# EAGLE design LEDAppBoard-0BAC0304 (EAGLE 5.10)
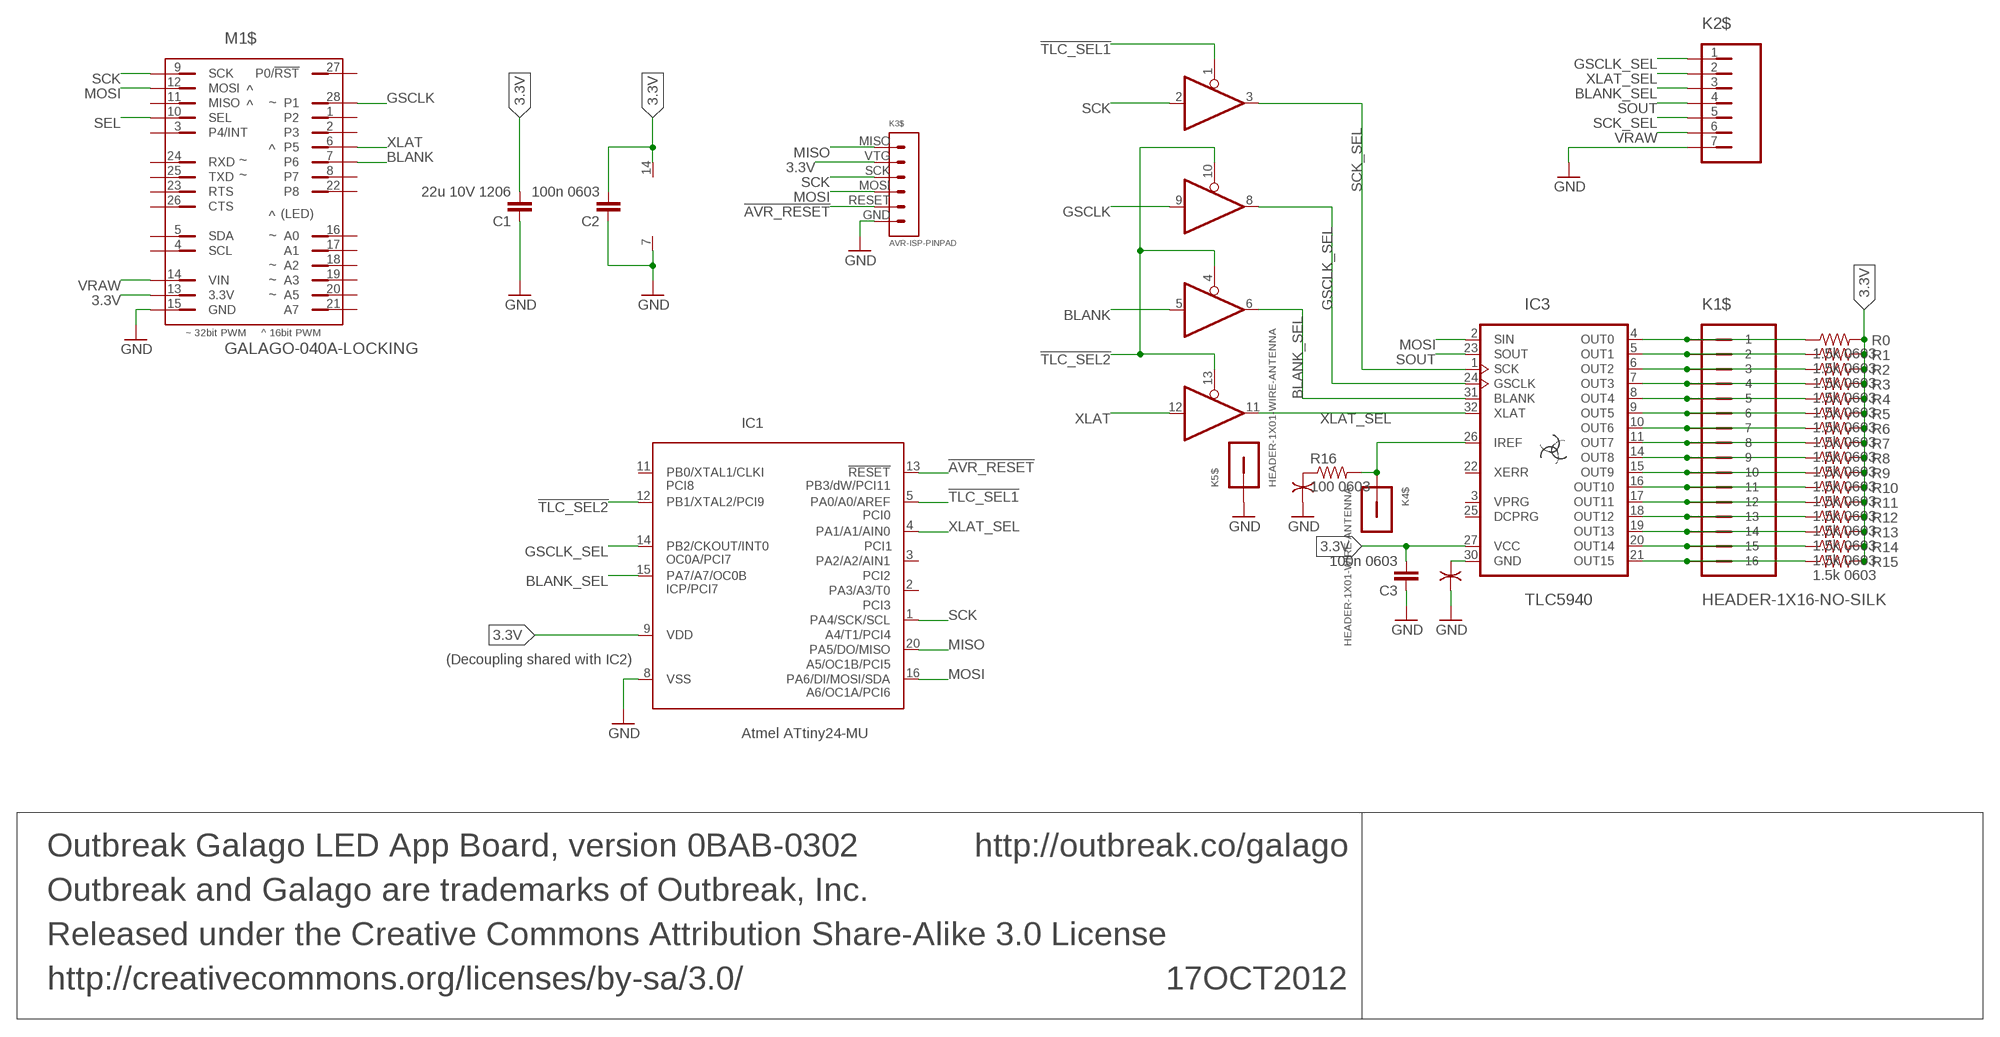
[diagram p0: schematic, sheet 1]

## Parts
17OCT2012  Outbreak Galago LED App Board, version 0BAB-0302  INFO-BLOCK  [INFO-BLOCK]
C1  22u 10V 1206  CAP-1206  [1206]
C2  100n 0603  CAP-0603-MIN  [0603-MIN]
C3  100n 0603  CAP-0603-MIN  [0603-MIN]
G1$  GND-ISOLATOR-0.008"  [GND-ISOLATOR-0.008"]
G2$  GND-ISOLATOR-0.008"  [GND-ISOLATOR-0.008"]
IC1  Atmel ATtiny24-MU  AVR-ATTINY24/44/84-QFN20  [QFN20-0.5MM]
IC2  74HC125-TSSOP14  [TSSOP14]
IC3  TLC5940  TI-TLC5940-QFN32  [QFN32-0.5MM]
K1$  HEADER-1X16-NO-SILK  [HEADER-1X16-NO-SILK]
K2$  HEADER-1X07-NO-SILK  [HEADER-1X07-NO-SILK]
K3$  AVR-ISP-PINPAD  [AVR-ISP-PINPAD]
K4$  HEADER-1X01-WIRE-ANTENNA  [HEADER-1X01-WIRE-ANTENNA]
K5$  HEADER-1X01-WIRE-ANTENNA  [HEADER-1X01-WIRE-ANTENNA]
M1$  GALAGO-040A-LOCKING  [GALAGO-LOCKING]
R0  1.5k 0603  RESISTOR-0603-MIN  [0603-MIN]
R1  1.5k 0603  RESISTOR-0603-MIN  [0603-MIN]
R2  1.5k 0603  RESISTOR-0603-MIN  [0603-MIN]
R3  1.5k 0603  RESISTOR-0603-MIN  [0603-MIN]
R4  1.5k 0603  RESISTOR-0603-MIN  [0603-MIN]
R5  1.5k 0603  RESISTOR-0603-MIN  [0603-MIN]
R6  1.5k 0603  RESISTOR-0603-MIN  [0603-MIN]
R7  1.5k 0603  RESISTOR-0603-MIN  [0603-MIN]
R8  1.5k 0603  RESISTOR-0603-MIN  [0603-MIN]
R9  1.5k 0603  RESISTOR-0603-MIN  [0603-MIN]
R10  1.5k 0603  RESISTOR-0603-MIN  [0603-MIN]
R11  1.5k 0603  RESISTOR-0603-MIN  [0603-MIN]
R12  1.5k 0603  RESISTOR-0603-MIN  [0603-MIN]
R13  1.5k 0603  RESISTOR-0603-MIN  [0603-MIN]
R14  1.5k 0603  RESISTOR-0603-MIN  [0603-MIN]
R15  1.5k 0603  RESISTOR-0603-MIN  [0603-MIN]
R16  100 0603  RESISTOR-0603  [0603]

## Nets
3.3V: C1.1 C2.1 C3.1 IC1.9(VDD) IC2.14(VDD) IC3.27(VCC) K3$.VTG M1$.13(3.3V) R0.2 R1.2 R2.2 R3.2 R4.2 R5.2 R6.2 R7.2 R8.2 R9.2 R10.2 R11.2 R12.2 R13.2 R14.2 R15.2
!AVR_RESET: IC1.13(!RESET) K3$.RESET
!TLC_SEL1: IC1.5(PA0/A0/AREF) IC2.1(EN)
!TLC_SEL2: IC1.12(PB1/XTAL2/PCI9) IC2.4(EN) IC2.10(EN) IC2.13(EN)
BLANK: IC2.5(A) M1$.7(P6)
BLANK_SEL: IC1.15(PA7/A7/OC0B) IC2.6(Y) IC3.31(BLANK) K2$.3
GND: C1.2 C2.2 C3.2 G1$.1(A) G2$.1(A) IC1.8(VSS) IC2.7(VSS) K2$.7 K3$.GND K5$.1 M1$.15(GND)
GSCLK: IC2.9(A) M1$.28(P1)
GSCLK_SEL: IC1.14(PB2/CKOUT/INT0) IC2.8(Y) IC3.24(GSCLK) K2$.1
IREF: IC3.26(IREF) K4$.1 R16.2
MISO: IC1.20(PA5/DO/MISO) K3$.MISO
MOSI: IC1.16(PA6/DI/MOSI/SDA) IC3.2(SIN) K3$.MOSI M1$.12(MOSI)
N$18: G2$.2(B) R16.1
N$19: IC3.4(OUT0) K1$.1 R0.1
N$21: IC3.5(OUT1) K1$.2 R1.1
N$22: IC3.6(OUT2) K1$.3 R2.1
N$23: IC3.7(OUT3) K1$.4 R3.1
N$24: IC3.8(OUT4) K1$.5 R4.1
N$25: IC3.9(OUT5) K1$.6 R5.1
N$26: IC3.10(OUT6) K1$.7 R6.1
N$27: IC3.11(OUT7) K1$.8 R7.1
N$28: IC3.14(OUT8) K1$.9 R8.1
N$29: IC3.15(OUT9) K1$.10 R9.1
N$30: IC3.16(OUT10) K1$.11 R10.1
N$31: IC3.17(OUT11) K1$.12 R11.1
N$32: IC3.18(OUT12) K1$.13 R12.1
N$33: IC3.19(OUT13) K1$.14 R13.1
N$34: IC3.20(OUT14) K1$.15 R14.1
N$35: IC3.21(OUT15) K1$.16 R15.1
SCK: IC1.1(PA4/SCK/SCL) IC2.2(A) K3$.SCK M1$.9(SCK)
SCK_SEL: IC2.3(Y) IC3.1(SCK) K2$.5
SEL: M1$.10(SEL)
SOUT: IC3.23(SOUT) K2$.4
THERMGND: G1$.2(B) IC3.30(GND)
VRAW: K2$.6 M1$.14(VIN)
XLAT: IC2.12(A) M1$.6(P5)
XLAT_SEL: IC1.4(PA1/A1/AIN0) IC2.11(Y) IC3.32(XLAT) K2$.2
Unconnected: IC1.2(PA3/A3/T0) IC1.3(PA2/A2/AIN1) IC1.11(PB0/XTAL1/CLKI) IC3.3(VPRG) IC3.22(XERR) IC3.25(DCPRG) M1$.1(P2) M1$.2(P3) M1$.3(P4/INT) M1$.4(SCL) M1$.5(SDA) M1$.8(P7) M1$.11(MISO) M1$.16(A0) M1$.17(A1) M1$.18(A2) M1$.19(A3) M1$.20(A5) M1$.21(A7) M1$.22(P8) M1$.23(RTS) M1$.24(RXD) M1$.25(TXD) M1$.26(CTS) M1$.27(P0/!RST)

## Notes on the sheet
- (Decoupling shared with IC2)

## Library data of the parts
17OCT2012 = Outbreak:INFO-BLOCK
C1-C3 = Outbreak:CAP
G1$ G2$ = Outbreak:GND-ISOLATOR
IC1 = Outbreak:AVR-ATTINY24/44/84
IC2 = Outbreak:74HC125
IC3 = Outbreak:TI-TLC5940
K1$ = Outbreak:HEADER-1X16-NO-SILK
K2$ = Outbreak:HEADER-1X07-NO-SILK
K3$ = Outbreak:AVR-ISP-PINPAD
K4$ K5$ = Outbreak:HEADER-1X01
M1$ = Outbreak-v0:GALAGO-040A
R0 R1-R16 = Outbreak:RESISTOR: Resistor Basic schematic elements and footprints for 0603, 1206, and PTH resistors.

## Board
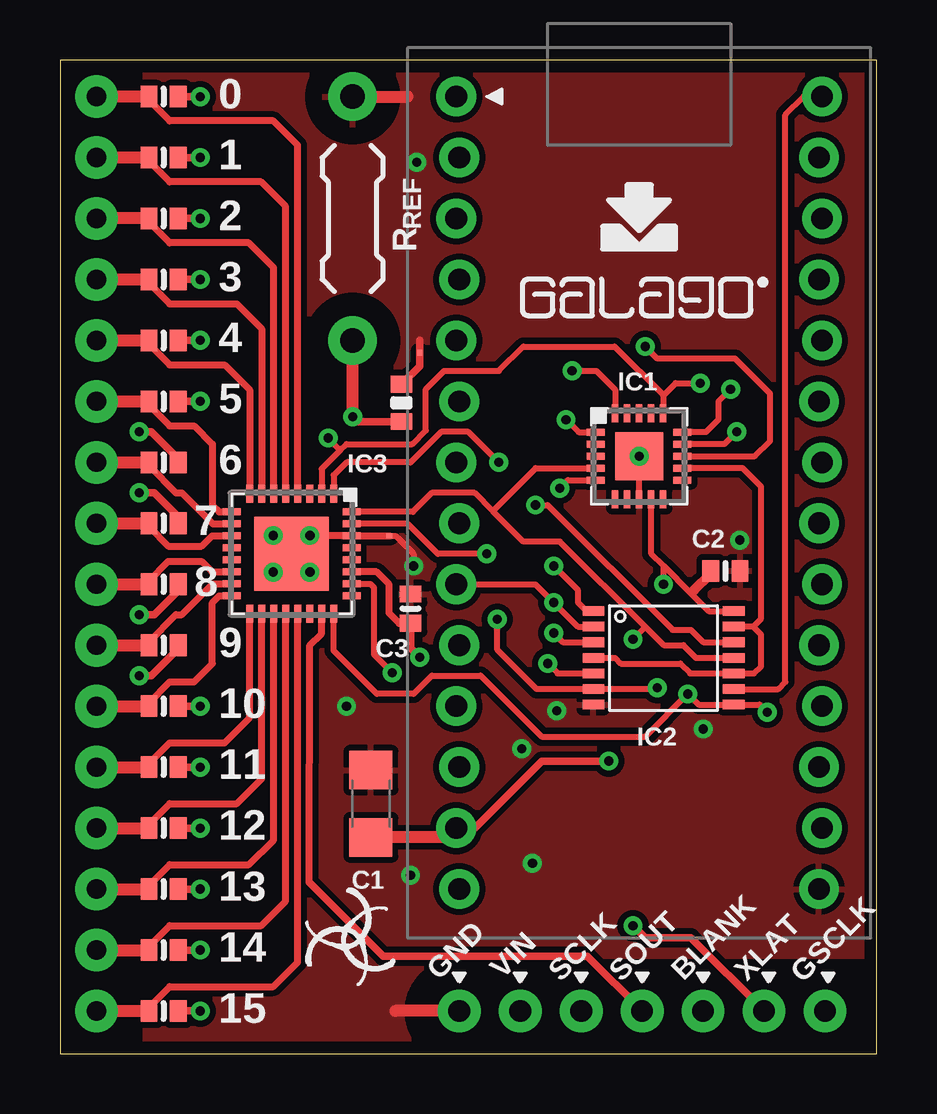
[diagram p1: board, top side]
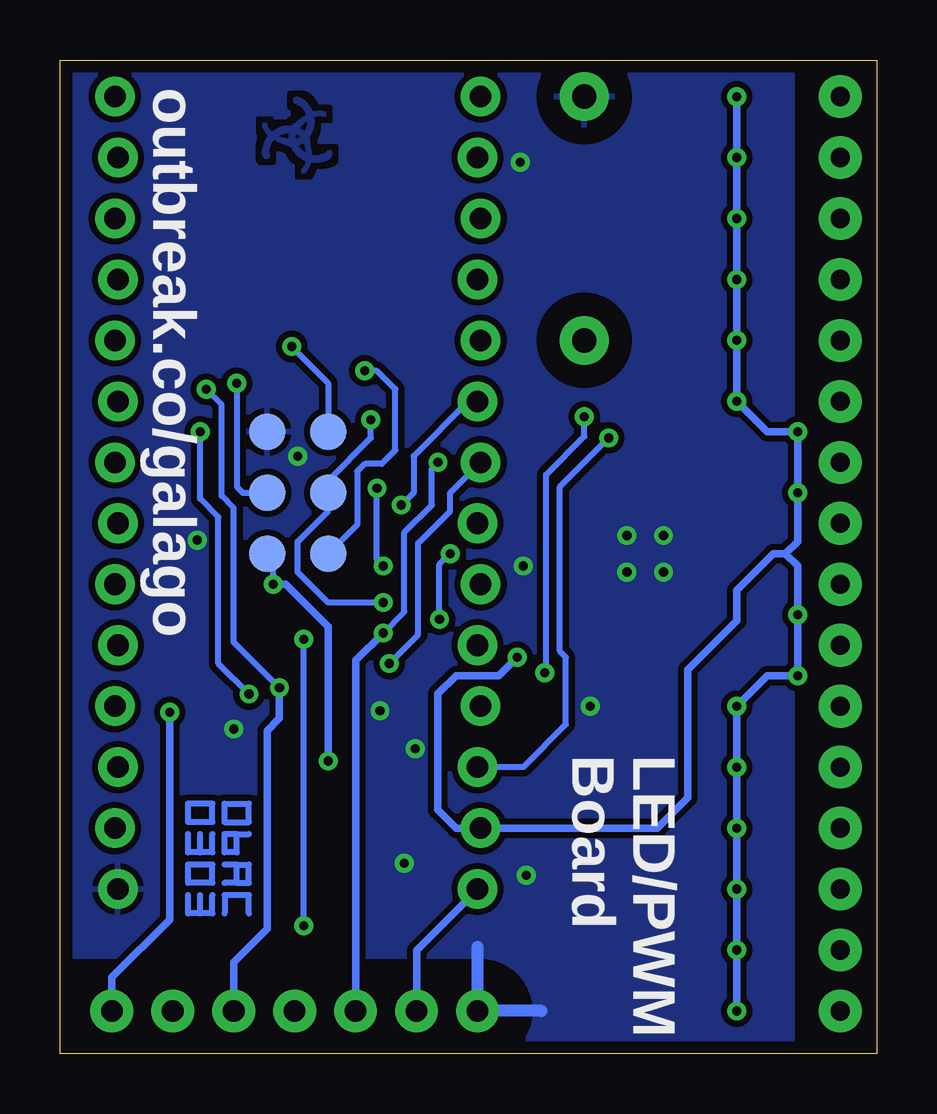
[diagram p2: board, bottom side, seen from below]

Size 34.04 x 41.4 mm. Coordinates in mm from the lower left corner, seen from the top.
Outline: 0,0 34.04,0 34.04,41.4 0,41.4 0,0
Copper layers (1*16): Top 0.035mm / dielectric 1.5mm / Bottom 0.035mm
Design rules "default *": minimum track width 8mil, minimum drill 20mil, track to track 8mil, track to pad 8mil, pad to pad 8mil, via to via 8mil, smd to smd 8mil, copper to edge 20mil, drill to drill 8mil, minimum pad ring 10mil, minimum via ring 8mil, stop-mask expansion 4mil, vias tented up to drill 25mil, thermal gap 10mil
tRestrict: area 10.6,28.1 to 13.8,31.3; area 14.7,0 to 33.8,3.6; area 10.6,38.3 to 13.8,41.5
bRestrict: area 10.6,28.1 to 13.8,31.3; area 14.7,0 to 33.8,3.6; area 10.6,38.3 to 13.8,41.5

### Footprints (pad centres in the part's own frame; a part is rotated, then mirrored left to right if it is on the bottom)
1206 = smd 1.6 x 1.8: 1 -1.4,0; 2 1.4,0
0603-MIN = smd 0.7 x 0.9: 1 -0.61,0; 2 0.61,0
GND-ISOLATOR-0.008" = smd 0.203 x 0.203: 1 -0.025,0; 2 0.025,0
QFN20-0.5MM = smd 0.75 x 0.28: 1 -1.8,1; 2 -1.8,0.5; 3 -1.8,0; 4 -1.8,-0.5; 5 -1.8,-1; 11 1.8,-1; 12 1.8,-0.5; 13 1.8,0; 14 1.8,0.5; 15 1.8,1 | smd 0.28 x 0.75: 6 -1,-1.8; 7 -0.5,-1.8; 8 0,-1.8; 9 0.5,-1.8; 10 1,-1.8; 16 1,1.8; 17 0.5,1.8; 18 0,1.8; 19 -0.5,1.8; 20 -1,1.8 | smd 2 x 2: G1 0,0
TSSOP14 = smd 0.4 x 0.9: 1 2.275,2.925; 2 1.625,2.925; 3 0.975,2.925; 4 0.325,2.925; 5 -0.325,2.925; 6 -0.975,2.925; 7 -1.625,2.925; 8 -1.625,-2.925; 9 -0.975,-2.925; 10 -0.325,-2.925; 11 0.325,-2.925; 12 0.975,-2.925; 13 1.625,-2.925; 14 2.275,-2.925
QFN32-0.5MM = smd 0.75 x 0.295: 1 -2.5,1.75; 2 -2.5,1.25; 3 -2.5,0.75; 4 -2.5,0.25; 5 -2.5,-0.25; 6 -2.5,-0.75; 7 -2.5,-1.25; 8 -2.5,-1.75; 17 2.5,-1.75; 18 2.5,-1.25; 19 2.5,-0.75; 20 2.5,-0.25; 21 2.5,0.25; 22 2.5,0.75; 23 2.5,1.25; 24 2.5,1.75 | smd 0.295 x 0.75: 9 -1.75,-2.5; 10 -1.25,-2.5; 11 -0.75,-2.5; 12 -0.25,-2.5; 13 0.25,-2.5; 14 0.75,-2.5; 15 1.25,-2.5; 16 1.75,-2.5; 25 1.75,2.5; 26 1.25,2.5; 27 0.75,2.5; 28 0.25,2.5; 29 -0.25,2.5; 30 -0.75,2.5; 31 -1.25,2.5; 32 -1.75,2.5 | smd 3.1 x 3.1: G1 0,0
HEADER-1X16-NO-SILK = drill 0.8 pad 1.778 round: 1 -19.05,0; 2 -16.51,0; 3 -13.97,0; 4 -11.43,0; 5 -8.89,0; 6 -6.35,0; 7 -3.81,0; 8 -1.27,0; 9 1.27,0; 10 3.81,0; 11 6.35,0; 12 8.89,0; 13 11.43,0; 14 13.97,0; 15 16.51,0; 16 19.05,0
HEADER-1X07-NO-SILK = drill 0.9 pad 1.778 round: 1 -7.62,0; 2 -5.08,0; 3 -2.54,0; 4 0,0; 5 2.54,0; 6 5.08,0; 7 7.62,0
AVR-ISP-PINPAD = smd 1.524 x 1.524: GND 2.54,1.27; MISO -2.54,-1.27; MOSI 0,1.27; RESET 2.54,-1.27; SCK 0,-1.27; VTG -2.54,1.27
HEADER-1X01-WIRE-ANTENNA = drill 1.016 pad 2.032 round: 1 0,0
GALAGO-LOCKING = drill 0.9 pad 1.651 round: 1 -7.62,16.51; 2 -7.493,13.97; 3 -7.62,11.43; 4 -7.493,8.89; 5 -7.62,6.35; 6 -7.493,3.81; 7 -7.62,1.27; 8 -7.493,-1.27; 9 -7.62,-3.81; 10 -7.493,-6.35; 11 -7.62,-8.89; 12 -7.493,-11.43; 13 -7.62,-13.97; 14 -7.493,-16.51; 15 7.493,-16.51; 16 7.62,-13.97; 17 7.493,-11.43; 18 7.62,-8.89; 19 7.493,-6.35; 20 7.62,-3.81; 21 7.493,-1.27; 22 7.62,1.27; 23 7.493,3.81; 24 7.62,6.35; 25 7.493,8.89; 26 7.62,11.43; 27 7.493,13.97; 28 7.62,16.51
0603 = smd 0.7 x 0.9: 1 -0.777,0; 2 0.777,0

### Placement (x,y rotation side)
17OCT2012  -7.37,-2.29 0 top  (outside the outline)
C1  12.95,10.41 90 top
C2  27.72,20.12 0 top
C3  14.61,18.54 90 top
G1$  13.72,21.58 0 top
G2$  14.99,29.21 270 top
IC1  24.13,24.89 0 top
IC2  25.15,16.17 90 top
IC3  9.65,20.83 270 top
K1$  1.52,20.83 270 top
K2$  24.26,1.78 180 top
K3$  24.13,23.37 90 bottom
K4$  12.19,29.72 0 top
K5$  12.19,39.88 0 top
M1$  24.13,23.37 0 top
R0  4.32,39.88 0 top
R1  4.32,37.34 0 top
R2  4.32,34.8 0 top
R3  4.32,32.26 0 top
R4  4.32,29.72 0 top
R5  4.32,27.18 0 top
R6  4.32,24.64 0 top
R7  4.32,22.1 0 top
R8  4.32,19.56 0 top
R9  4.32,17.02 0 top
R10  4.32,14.48 0 top
R11  4.32,11.94 0 top
R12  4.32,9.4 0 top
R13  4.32,6.86 0 top
R14  4.32,4.32 0 top
R15  4.32,1.78 0 top
R16  14.22,27.11 270 top
U$3  [GALAGO-LOGO]  24.13,31.5 0 top
U$4  [GALAGO-APP-BOARD-SYMBOL]  24.13,34.29 0 top

### Tracks (layer width: path | path; a pad name or v marks a point on that pad's centre or on a via)
3.3V  (via drill 0.38)
  Top 0.254: IC1.9 24.64,20.83 25.15,20.32 | 25.15,20.32 26.29,19.18 | 26.29,19.18 26.42,19.3 | v25.15,19.56 25.15,20.32 | 26.29,19.18 27.02,18.44 IC2.14
  Top 0.292: IC3.27 13.2,20.08 13.72,19.56 13.72,18.35 14.13,17.93 C3.1
  Top 0.305: v5.84,39.88 R0.2 | v5.84,37.34 R1.2 | v5.84,34.8 R2.2 | v5.84,32.26 R3.2 | v5.84,29.72 R4.2 | v5.84,27.18 R5.2 | R15.2 v5.84,1.78 | v5.84,4.32 R14.2 | v5.84,6.86 R13.2 | v5.84,9.4 R12.2 | v5.84,11.94 R11.2 | v5.84,14.48 R10.2 | R7.2 4.93,22.38 3.94,23.37 v3.3,23.37 | R8.2 4.93,19.28 3.94,18.29 v3.3,18.29 | R9.2 4.93,16.87 3.81,15.75 v3.3,15.75 | R6.2 4.93,24.79 3.81,25.91 v3.3,25.91 | C3.1 14.61,16.89 v14.99,16.51 | v22.86,12.19 20.07,12.19 17.27,9.4 M1$.13
  Top 0.406: C2.1 27.11,20 26.42,19.3
  Top 0.508: M1$.13 16.13,9.01 C1.1
  Bottom 0.254: K3$.VTG 25.15,20.57 v25.15,19.56
  Bottom 0.305: v5.84,39.88 v5.84,37.34 v5.84,34.8 v5.84,32.26 v5.84,29.72 v5.84,27.18 4.57,25.91 v3.3,25.91 v3.3,23.37 3.3,21.34 3.81,20.83 | v5.84,1.78 v5.84,4.32 v5.84,6.86 v5.84,9.4 v5.84,11.94 v5.84,14.48 4.57,15.75 v3.3,15.75 v3.3,18.29 3.3,20.32 3.81,20.83 | v14.99,16.51 15.75,15.75 17.53,15.75 18.29,14.99 18.29,10.16 17.53,9.4 M1$.13 9.14,9.4 7.87,10.67 7.87,16 5.84,18.03 5.84,19.3 4.32,20.83 3.81,20.83 | v25.15,19.56 24.64,19.56 22.86,17.78 v22.86,12.19
!AVR_RESET  (via drill 0.38)
  Top 0.254: IC1.13 28.96,24.89 29.59,25.53 29.59,27.5 28.13,28.96 24.89,28.96 v24.38,29.46
  Bottom 0.254: K3$.RESET 22.86,27.94 v24.38,29.46
!TLC_SEL1  (via drill 0.38)
  Top 0.254: v20.57,20.32 21.59,19.3 21.59,18.8 21.94,18.44 IC2.1 | v20.83,23.56 21.16,23.89 IC1.5
  Bottom 0.254: v20.57,20.32 20.83,20.57 v20.83,23.56
!TLC_SEL2
  Top 0.254: IC1.12 28.44,24.39 29.21,23.62 29.21,18.12 28.88,17.79 | IC2.4 23.13,16.49 23.37,16.26 25.84,16.26 26.26,15.84 IC2.10 28.92,15.84 29.21,16.13 29.21,17.46 28.88,17.79 | 28.88,17.79 IC2.13
BLANK  (via drill 0.38)
  Top 0.254: v20.32,16.26 20.73,15.84 IC2.5
  Bottom 0.254: v20.32,16.26 19.11,17.46 19.11,21.27 17.78,22.61 17.78,23.37 M1$.7
BLANK_SEL  (via drill 0.38)
  Top 0.254: v17.78,20.83 15.75,20.83 14.5,22.08 IC3.31 | v18.22,18.1 18.22,16.83 19.86,15.19 IC2.6 24.84,15.19 v24.89,15.24 | v27.94,27.69 27.43,27.18 27.43,26.42 26.91,25.89 IC1.15
  Bottom 0.254: v18.22,18.1 18.22,20.38 v17.78,20.83 | v24.89,15.24 26.8,17.14 26.8,22.73 27.3,23.24 27.3,27.05 v27.94,27.69
  Bottom 0.305: K2$.3 26.8,3.81 25.4,5.21 25.4,13.46 24.89,13.97 v24.89,15.24
GND  (via drill 0.38)
  Top 0.254: G1$.1 13.98,21.58 14.73,20.83 v14.73,20.32 | IC1.8 v24.13,24.89
  Top 0.305: G2$.1 14.99,29.72
  Top 0.508: K5$.1 14.48,39.88 | K2$.7 13.97,1.78
  Bottom 0.508: 16.64,4.45 K2$.7 13.97,1.78
  other vias: 8.89,21.59 10.41,20.07 10.41,21.59 8.89,20.07 28.32,21.4 20.7,14.29 26.8,13.53 19.68,7.94 14.61,7.43 11.94,14.48 14.86,37.15 19.24,12.7
  pour Top (isolate 0.254): 3.56,41.4 3.56,0 34.04,0 34.04,41.4
  pour Bottom (isolate 0.254, rank 2): 3.56,41.4 3.56,0 34.04,0 34.04,41.4
GSCLK
  Top 0.254: M1$.28 30.99,39.88 30.23,39.12 30.23,15.49 29.92,15.19 IC2.9
GSCLK_SEL  (via drill 0.38)
  Top 0.254: IC3.24 11.4,16.79 13.21,14.99 14.73,14.99 15.49,15.75 17.53,15.75 20.07,13.21 24.38,13.21 v26.16,14.99 26.61,14.54 IC2.8 29.15,14.54 v29.46,14.22 | IC1.14 27.68,25.39 v28.19,25.91
  Bottom 0.254: v26.16,14.99 27.43,16.26 27.43,22.35 28.19,23.11 v28.19,25.91
  Bottom 0.305: K2$.1 31.88,3.17 29.46,5.59 v29.46,14.22
IREF  (via drill 0.38)
  Top 0.254: IC3.26 12.93,19.58 13.08,19.43 13.08,16.64 v13.84,15.88
  Top 0.305: v12.19,26.54 12.4,26.34 R16.2
  Top 0.508: v12.19,26.54 K4$.1
  Bottom 0.254: v13.84,15.88 13.78,15.94 13.78,24.13 12.19,25.72 v12.19,26.54
MISO  (via drill 0.38)
  Top 0.254: v21.34,28.45 22.35,28.45 23.13,27.67 IC1.20
  Bottom 0.254: K3$.MISO 21.65,22.04 21.65,24.26 21.34,24.57 20.64,24.57 20.07,25.15 20.07,27.69 20.83,28.45 v21.34,28.45
MOSI  (via drill 0.38)
  Top 0.254: IC3.2 10.9,24.36 11.68,25.15 | 11.68,25.15 11.94,25.4 14.67,25.4 15.24,25.97 15.24,27.69 16,28.45 18.29,28.45 19.3,29.46 23.11,29.46 25.13,27.45 25.13,27.42 | v11.18,25.65 11.68,25.15 | v26.67,27.94 25.65,27.94 25.13,27.42 | 25.13,27.42 IC1.16
  Bottom 0.254: M1$.12 14.73,11.94 12.95,13.72 12.95,16.51 13.21,16.76 13.21,23.62 v11.18,25.65 | K3$.MOSI 26.42,23.37 26.67,23.62 v26.67,27.94
N$1
  Bottom 0.254: 26.16,9.65 26.16,10.41 27.18,10.41 27.18,9.65 26.16,9.65
N$2
  Bottom 0.254: 26.67,9.14 27.18,9.14 27.18,8.38 26.67,8.38 26.67,9.14 | 26.67,9.14 26.16,9.14
N$3
  Bottom 0.254: 26.67,7.11 26.16,7.11 26.16,7.87 26.67,7.87 | 26.67,7.11 27.18,7.11 | 26.67,7.87 27.18,7.87 | 26.67,7.11 26.67,7.87
N$4
  Bottom 0.254: 27.18,5.84 27.18,6.6 26.16,6.6 26.16,5.84
N$5
  Bottom 0.254: 27.69,9.65 27.69,10.41 28.7,10.41 28.7,9.65 27.69,9.65
N$6
  Bottom 0.254: 27.69,9.14 27.69,8.38 28.19,8.38 | 28.19,8.38 28.19,9.14 | 28.7,9.14 28.7,8.38 28.19,8.38
N$7
  Bottom 0.254: 27.69,7.11 27.69,7.87 28.7,7.87 28.7,7.11 27.69,7.11
N$8
  Bottom 0.254: 27.69,6.6 27.69,5.84 28.19,5.84 | 28.19,5.84 28.19,6.6 | 28.7,6.6 28.7,5.84 28.19,5.84
N$9
  pour Bottom: 23.13,39.18 23.17,39.18 23.26,39.18 23.34,39.17 23.42,39.16 23.5,39.14 23.54,39.13 23.53,39.1 23.5,39.11 23.45,39.13 23.4,39.15 23.34,39.16 23.29,39.16 23.23,39.17 23.18,39.17 23.12,39.16 23.07,39.15 23.07,39.15 23.06,39.15 23.04,39.13 23.04,39.13 23.04,39.12 23.03,39.12 23.03,39.12 23.02,39.12 23.02,39.12 23.02,39.13 23.02,39.14 23.03,39.15 23.05,39.16 23.06,39.17 23.08,39.17 23.09,39.18 23.1,39.18 23.11,39.18
N$10
  pour Bottom: 23.67,39.1 23.67,39.08 23.66,39.03 23.66,39.03 23.65,39.01 23.64,38.93 23.64,38.86 23.64,38.78 23.65,38.71 23.66,38.63 23.68,38.56 23.71,38.49 23.74,38.41 23.74,38.41 23.79,38.33 23.79,38.32 23.77,38.31 23.75,38.3 23.74,38.28 23.73,38.25 23.7,38.28 23.66,38.34 23.66,38.34 23.62,38.43 23.58,38.51 23.55,38.6 23.53,38.69 23.52,38.77 23.52,38.86 23.53,38.96 23.54,39.05 23.55,39.09 23.56,39.13 23.57,39.14 23.59,39.21 23.61,39.26 23.64,39.31 23.66,39.36 23.7,39.41 23.73,39.46 23.78,39.51 23.82,39.56 23.87,39.61 23.91,39.65 23.96,39.69 24,39.72 24.03,39.74 24.07,39.76 24.1,39.76 24.12,39.77 24.15,39.76 24.16,39.76 24.18,39.76 24.2,39.76 24.21,39.76 24.21,39.76 24.22,39.75 24.23,39.74 24.23,39.74 24.25,39.72 24.25,39.7 24.25,39.7 24.24,39.69 24.23,39.69 24.21,39.68 24.18,39.67 24.1,39.63 24.03,39.59 23.97,39.55 23.92,39.51 23.87,39.47 23.83,39.42 23.79,39.38 23.76,39.32 23.73,39.27 23.71,39.21 23.67,39.1
N$11
  pour Bottom: 23.7,39.02 23.7,39.02 23.68,39.03 23.69,39.06 23.71,39.05 23.79,39.01 23.86,38.95 23.93,38.9 24,38.85 24.06,38.8 24.11,38.75 24.16,38.71 24.21,38.68 24.25,38.65 24.29,38.62 24.33,38.59 24.36,38.55 24.38,38.53 24.4,38.5 24.4,38.48 24.4,38.45 24.4,38.45 24.4,38.45 24.39,38.41 24.38,38.37 24.38,38.34 24.39,38.31 24.39,38.29 24.4,38.27 24.4,38.26 24.4,38.25 24.4,38.25 24.41,38.21 24.41,38.16 24.4,38.11 24.39,38.04 24.39,38.04 24.39,38.04 24.39,38.04 24.31,38.03 24.31,38.04 24.32,38.1 24.33,38.14 24.33,38.19 24.33,38.23 24.32,38.27 24.3,38.32 24.28,38.37 24.26,38.42 24.26,38.42 24.25,38.43 24.23,38.48 24.19,38.52 24.18,38.54 24.12,38.63 24.06,38.71 23.99,38.78 23.92,38.85 23.87,38.9 23.81,38.94 23.76,38.98
N$12
  pour Bottom: 23.74,38.19 23.74,38.22 23.74,38.22 23.75,38.25 23.77,38.28 23.79,38.3 23.81,38.31 23.81,38.31 23.82,38.31 23.83,38.31 23.87,38.32 23.9,38.33 23.92,38.35 23.94,38.37 23.94,38.37 23.99,38.41 24.02,38.43 24.06,38.46 24.1,38.48 24.16,38.5 24.18,38.5 24.18,38.51 24.18,38.51 24.2,38.47 24.22,38.43 24.18,38.42 24.14,38.41 24.1,38.39 24.07,38.38 24.05,38.36 24.01,38.33 23.98,38.29 23.95,38.26 23.92,38.21 23.92,38.21 23.9,38.19 23.85,38.09 23.83,38.06 23.79,37.97 23.76,37.88 23.73,37.79 23.7,37.69 23.69,37.62 23.68,37.54 23.67,37.47 23.67,37.41 23.67,37.4 23.64,37.39 23.64,37.41 23.64,37.41 23.64,37.5 23.65,37.59 23.66,37.68 23.68,37.84 23.7,37.91 23.7,37.97 23.71,38.03 23.72,38.08 23.73,38.13 23.73,38.16
N$13
  pour Bottom: 23.68,37.38 23.71,37.38 23.78,37.41 23.85,37.45 23.91,37.49 23.97,37.53 24.03,37.58 24.08,37.63 24.13,37.69 24.18,37.76 24.22,37.82 24.23,37.84 24.25,37.83 24.27,37.83 24.3,37.83 24.33,37.83 24.32,37.82 24.27,37.72 24.27,37.72 24.22,37.64 24.17,37.57 24.1,37.5 24.04,37.43 23.96,37.38 23.88,37.33 23.8,37.29 23.7,37.26 23.69,37.26 23.64,37.25 23.61,37.24 23.56,37.23 23.51,37.22 23.45,37.22 23.39,37.22 23.33,37.22 23.27,37.23 23.21,37.24 23.14,37.25 23.08,37.27 23.01,37.29 22.96,37.31 22.92,37.33 22.88,37.35 22.85,37.37 22.83,37.39 22.81,37.41 22.8,37.43 22.8,37.43 22.8,37.45 22.79,37.46 22.79,37.46 22.78,37.48 22.78,37.49 22.78,37.49 22.78,37.5 22.78,37.52 22.79,37.53 22.79,37.54 22.8,37.55 22.81,37.55 22.82,37.55 22.83,37.54 22.84,37.53 22.87,37.51 22.94,37.46 23.01,37.42 23.01,37.42 23.07,37.39 23.13,37.36 23.19,37.34 23.25,37.33 23.31,37.32 23.38,37.32 23.44,37.32 23.5,37.33 23.59,37.35 23.63,37.36 23.63,37.36 23.68,37.38
N$14
  pour Bottom: 23.66,37.22 23.68,37.23 23.69,37.2 23.7,37.14 23.71,37.09 23.73,37.04 23.75,36.99 23.78,36.94 23.8,36.89 23.84,36.85 23.87,36.81 23.9,36.79 23.91,36.79 23.92,36.78 23.92,36.78 23.92,36.78 23.91,36.77 23.89,36.77 23.87,36.78 23.85,36.8 23.85,36.8 23.84,36.81 23.84,36.82 23.83,36.83 23.82,36.85 23.82,36.85 23.8,36.88 23.75,36.96 23.72,37.04 23.69,37.12 23.67,37.2
N$15
  pour Bottom: 24.39,38.55 24.5,38.56 24.6,38.56 24.7,38.55 24.79,38.53 24.87,38.5 24.96,38.46 25.04,38.42 25.12,38.36 25.19,38.3 25.2,38.29 25.2,38.29 25.23,38.26 25.26,38.23 25.26,38.23 25.29,38.19 25.29,38.19 25.32,38.15 25.36,38.1 25.39,38.05 25.41,38 25.44,37.94 25.46,37.88 25.48,37.82 25.5,37.75 25.51,37.69 25.52,37.63 25.53,37.59 25.53,37.54 25.53,37.51 25.52,37.47 25.51,37.45 25.49,37.43 25.49,37.43 25.48,37.42 25.47,37.4 25.47,37.39 25.46,37.38 25.46,37.38 25.45,37.38 25.43,37.37 25.43,37.37 25.41,37.37 25.4,37.37 25.39,37.37 25.39,37.38 25.38,37.39 25.39,37.4 25.39,37.42 25.39,37.45 25.39,37.45 25.4,37.54 25.4,37.62 25.4,37.69 25.39,37.75 25.38,37.82 25.36,37.88 25.33,37.93 25.31,37.99 25.27,38.04 25.23,38.09 25.16,38.17 25.14,38.19 25.1,38.23 25.1,38.23 25.1,38.23 25.09,38.24 25.03,38.29 24.96,38.33 24.9,38.36 24.83,38.39 24.76,38.42 24.68,38.44 24.61,38.45 24.53,38.46 24.43,38.46 24.43,38.49 24.42,38.51 24.41,38.53
N$16
  pour Bottom: 25.52,38.71 25.53,38.7 25.53,38.69 25.52,38.67 25.52,38.65 25.52,38.65 25.51,38.64 25.5,38.62 25.49,38.61 25.48,38.57 25.43,38.49 25.37,38.42 25.32,38.35 25.26,38.29 25.25,38.28 25.23,38.3 25.25,38.32 25.3,38.35 25.33,38.39 25.37,38.43 25.4,38.48 25.43,38.52 25.46,38.57 25.48,38.62 25.5,38.67 25.5,38.67 25.5,38.69 25.5,38.71 25.5,38.7 25.49,38.72 25.5,38.72 25.5,38.72 25.5,38.73 25.51,38.72 25.51,38.72 25.52,38.72
N$17
  pour Bottom: 25.08,38.19 25.08,38.19 25.09,38.2 25.11,38.18 25.09,38.16 25.02,38.12 24.94,38.09 24.85,38.05 24.78,38.02 24.7,38 24.64,37.97 24.58,37.95 24.52,37.92 24.47,37.9 24.43,37.88 24.43,37.88 24.4,37.87 24.37,37.86 24.34,37.85 24.31,37.85 24.28,37.85 24.26,37.86 24.23,37.87 24.23,37.87 24.23,37.88 24.23,37.88 24.21,37.89 24.19,37.91 24.16,37.93 24.14,37.95 24.12,37.95 24.12,37.95 24.09,37.96 24.08,37.96 24.06,37.97 24.06,37.97 24.06,37.97 24.02,37.98 23.98,38.01 23.94,38.03 23.9,38.07 23.88,38.09 23.88,38.09 23.88,38.09 23.92,38.16 23.95,38.13 23.94,38.13 23.98,38.1 24.01,38.08 24.04,38.06 24.07,38.05 24.07,38.05 24.12,38.03 24.16,38.02 24.22,38.02 24.27,38.01 24.29,38.01 24.29,38.01 24.4,38.01 24.42,38.01 24.52,38.02 24.62,38.04 24.72,38.06 24.82,38.09 24.89,38.11 24.95,38.14 25.02,38.16
N$18
  Top 0.305: R16.1 14.99,28.64 G2$.2
N$19
  Top 0.292: IC3.4 9.9,37.85 8.89,38.86 4.57,38.86 3.71,39.73
  Top 0.305: 3.71,39.73 R0.1
  Top 0.508: R0.1 K1$.1
N$21
  Top 0.292: IC3.5 9.4,35.3 8.38,36.32 4.57,36.32 3.71,37.19
  Top 0.305: 3.71,37.19 R1.1
  Top 0.508: R1.1 K1$.2
N$22
  Top 0.292: IC3.6 8.9,32.75 7.87,33.78 4.57,33.78 3.71,34.65
  Top 0.305: 3.71,34.65 R2.1
  Top 0.508: R2.1 K1$.3
N$23
  Top 0.292: IC3.7 8.4,30.21 7.37,31.24 4.57,31.24 3.71,32.11
  Top 0.305: R3.1 3.71,32.11
  Top 0.508: K1$.4 R3.1
N$24
  Top 0.292: IC3.8 7.9,27.66 6.86,28.7 4.57,28.7 3.71,29.57
  Top 0.305: R4.1 3.71,29.57
  Top 0.508: K1$.5 R4.1
N$25
  Top 0.292: IC3.9 6.63,22.58 6.35,22.86 6.35,25.4 5.59,26.16 4.57,26.16 3.71,27.03
  Top 0.305: R5.1 3.71,27.03
  Top 0.508: K1$.6 R5.1
N$26
  Top 0.292: IC3.10 6.37,22.08 5.08,23.37 4.83,23.37 3.71,24.49
  Top 0.305: R6.1 3.71,24.49
  Top 0.508: K1$.7 R6.1
N$27
  Top 0.292: IC3.11 6.34,21.58 5.91,21.14 4.51,21.14 3.71,21.95
  Top 0.305: R7.1 3.71,21.95
  Top 0.508: K1$.8 R7.1
N$28
  Top 0.292: IC3.14 6.34,20.08 5.91,20.51 4.51,20.51 3.71,19.71
  Top 0.305: R8.1 3.71,19.71
  Top 0.508: K1$.9 R8.1
N$29
  Top 0.292: IC3.15 6.37,19.58 5.08,18.29 4.83,18.29 3.71,17.17
  Top 0.305: R9.1 3.71,17.17
  Top 0.508: K1$.10 R9.1
N$30
  Top 0.292: IC3.16 6.63,19.08 6.35,18.8 6.35,16.26 5.59,15.49 4.57,15.49 3.71,14.63
  Top 0.305: R10.1 3.71,14.63
  Top 0.508: K1$.11 R10.1
N$31
  Top 0.292: IC3.17 7.9,14 6.86,12.95 4.57,12.95 3.71,12.09
  Top 0.305: R11.1 3.71,12.09
  Top 0.508: K1$.12 R11.1
N$32
  Top 0.292: IC3.18 8.4,11.45 7.37,10.41 4.57,10.41 3.71,9.55
  Top 0.305: R12.1 3.71,9.55
  Top 0.508: K1$.13 R12.1
N$33
  Top 0.292: IC3.19 8.9,8.9 7.87,7.87 4.57,7.87 3.71,7.01
  Top 0.305: R13.1 3.71,7.01
  Top 0.508: K1$.14 R13.1
N$34
  Top 0.292: IC3.20 9.4,6.35 8.38,5.33 4.57,5.33 3.71,4.47
  Top 0.305: R14.1 3.71,4.47
  Top 0.508: K1$.15 R14.1
N$35
  Top 0.292: IC3.21 9.9,3.81 8.89,2.79 4.57,2.79 3.71,1.93
  Top 0.305: R15.1 3.71,1.93
  Top 0.508: K1$.16 R15.1
SCK  (via drill 0.38)
  Top 0.254: M1$.9 19.81,19.56 v20.57,18.8 21.58,17.79 IC2.2 | IC1.1 21.61,25.89 v21.08,26.42
  Bottom 0.254: v20.57,18.8 22.86,18.8 24.13,20.07 24.13,21.34 22.86,22.61 K3$.SCK 22.86,23.88 21.08,25.65 v21.08,26.42
SCK_SEL  (via drill 0.38)
  Top 0.254: IC3.1 11.4,24.1 11.94,24.64 14.61,24.64 15.88,25.91 17.02,25.91 v18.29,24.64 | v20.57,17.53 20.96,17.14 IC2.3
  Bottom 0.254: v20.57,17.53 19.68,18.41 19.68,21.72 18.54,22.86 18.54,24.38 v18.29,24.64
  Bottom 0.305: K2$.5 21.72,16.38 v20.57,17.53
SOUT
  Top 0.292: 10.39,7.13 10.41,17.02 10.9,17.51 IC3.23
  Top 0.305: K2$.4 21.97,4.06 13.46,4.06 10.39,7.13
THERMGND
  Top 0.292: 10.93,21.58 IC3.30 12.7,21.58 G1$.2
VRAW
  Bottom 0.305: M1$.14 19.18,4.32 K2$.6
XLAT  (via drill 0.38)
  Top 0.254: v19.81,22.86 20.32,22.86 25.53,17.65 26.29,17.65 26.8,17.14 IC2.12
  Bottom 0.254: v19.81,22.86 19.3,23.37 19.3,24.89 17.02,27.18 M1$.6
XLAT_SEL  (via drill 0.38)
  Top 0.254: IC3.32 14.7,22.58 15.49,23.37 17.27,23.37 18.03,22.61 | IC1.4 19.82,24.39 18.03,22.61 | 24.38,17.78 20.83,21.34 19.3,21.34 18.03,22.61 | 24.38,17.78 25.15,17.02 25.97,17.02 26.5,16.49 IC2.11 | v23.88,17.27 24.38,17.78
  Top 0.305: K2$.2 26.29,4.83 24.38,4.83 v23.88,5.33
  Bottom 0.254: v23.88,5.33 v23.88,17.27

### Text on the board
tPlace: 0 | 1 | 2 | REF | R | 3 | 4 | 5 | 6 | 7 | 8 | 9 | 10 | 11 | 12 | 13 | 14 | GND | VIN | SCLK | SOUT | BLANK | XLAT | GSCLK | 15
bPlace: outbreak.co/galago | LED/PWM | Board
tTest: Galago LED App Board | 0BAC-0303 (Top Side)